# Altium project Shank_v2.0 Project.PrjPcb
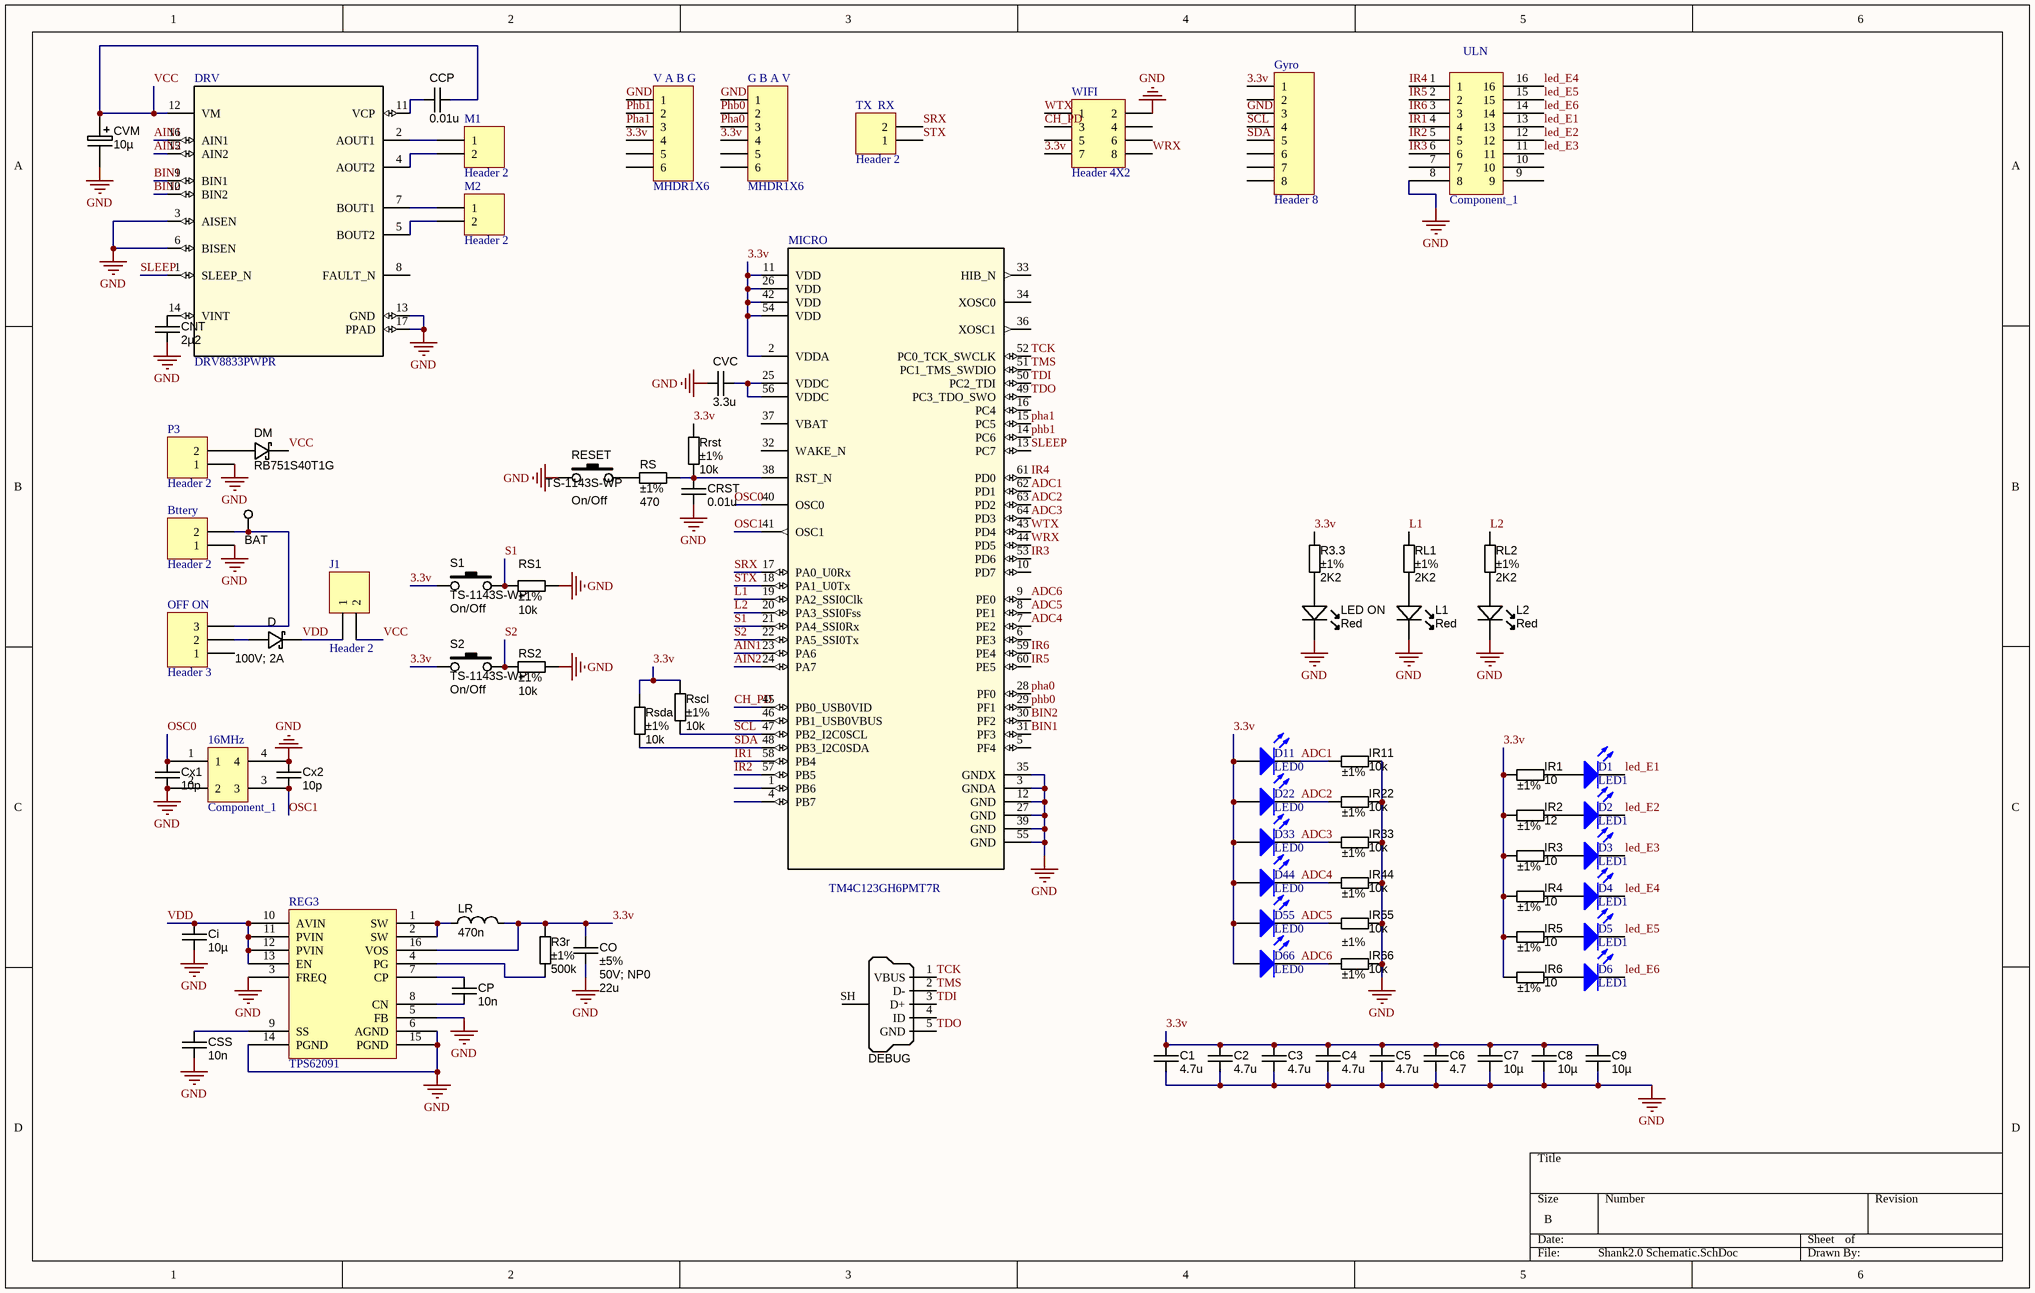
[diagram p0: Shank2.0 Schematic.SchDoc]
1 sheet, 81 parts. Net scope: global (net labels, ports and power ports of the same name join across sheets).
Board file: Shank2.0 PCB.PcbDoc

## Sheet Shank2.0 Schematic.SchDoc
size B

### Parts
16MHz  Component_1  [16Mhz]
BAT  TESTPOINT_LEAD  [THP_D46_T80_B80]  (value not drawn)  (no BOM)
Bttery  Header 2  [HDR1X2]
C1  value 4.7u  [CAPC2012X135N]  (hidden comment: approved sub OK)
C2  value 4.7u  [CAPC2012X135N]  (hidden comment: approved sub OK)
C3  value 4.7u  [CAPC2012X135N]  (hidden comment: approved sub OK)
C4  value 4.7u  [CAPC2012X135N]  (hidden comment: approved sub OK)
C5  value 4.7u  [CAPC2012X135N]  (hidden comment: approved sub OK)
C6  value 4.7  [CAPC2012X135N]  (hidden comment: approved sub OK)
C7  value 10µ  [CAPC2012X135N]  (hidden comment: approved sub OK)
C8  value 10µ  [CAPC2012X135N]  (hidden comment: approved sub OK)
C9  value 10µ  [CAPC2012X135N]  (hidden comment: approved sub OK)
CCP  value 0.01u  [CAPC2012X135N]  (hidden comment: approved sub OK)
Ci  value 10µ  [CAPC2012X135N]  (hidden comment: approved sub OK)
CNT  value 2µ2  [CAPC2012X135N]  (hidden comment: approved sub OK)
CO  Tolerance: ±5%  Ratings: 50V; NP0  [CAPC3216X180N]  (hidden comment: 22u)
CP  value 10n  [CAPC2012X135N]  (hidden comment: approved sub OK)
CRST  value 0.01u  [CAPC2012X135N]  (hidden comment: approved sub OK)
CSS  value 10n  [CAPC2012X135N]  (hidden comment: approved sub OK)
CVC  value 3.3u  [CAPC2012X135N]  (hidden comment: approved sub OK)
CVM  10µ  [CAPC3216X175N]
Cx1  value 10p  [CAPC2012X135N]  (hidden comment: approved sub OK)
Cx2  value 10p  [CAPC2012X135N]  (hidden comment: approved sub OK)
D  Ratings: 100V; 2A  [Schottky]  (hidden comment: DIODE_SCHOTTKY_10MQ100NPBF)
D1  LED1  [LED-v3.0]
D2  LED1  [LED-v3.0]
D3  LED1  [LED-v3.0]
D4  LED1  [LED-v3.0]
D5  LED1  [LED-v3.0]
D6  LED1  [LED-v3.0]
D11  LED0  [LED-1]
D22  LED0  [LED-1]
D33  LED0  [LED-1]
D44  LED0  [LED-1]
D55  LED0  [LED-1]
D66  LED0  [LED-1]
DEBUG  USB Micro Type B (recommended if hand soldering)  [USB_Micro-B_FCI_SMD]  (value not drawn)
DM  Manufacturer Part Number 1: RB751S40T1G  [Schottky]  (hidden comment: Low Ir)
DRV  DRV8833PWPR  [PWP0016C_N]
G_B_A_V  MHDR1X6  [Header Encoder]
Gyro  Header 8  [Header Gyroscope]
IR1  value 10  Tolerance: ±1%  [RESC3216N_ZERO]  (hidden comment: Thick Film)
IR2  value 12  Tolerance: ±1%  [RESC3216N_ZERO]  (hidden comment: Thick Film)
IR3  value 10  Tolerance: ±1%  [RESC3216X70N]  (hidden comment: Thick Film)
IR4  value 10  Tolerance: ±1%  [RESC3216X70N]  (hidden comment: Thick Film)
IR5  value 10  Tolerance: ±1%  [RESC3216X70N]  (hidden comment: Thick Film)
IR6  value 10  Tolerance: ±1%  [RESC3216X70N]  (hidden comment: Thick Film)
IR11  value 10k  Tolerance: ±1%  [RESC2012X70N]  (hidden comment: Thick Film)
IR22  value 10k  Tolerance: ±1%  [RESC2012X70N]  (hidden comment: Thick Film)
IR33  value 10k  Tolerance: ±1%  [RESC2012X70N]  (hidden comment: Thick Film)
IR44  value 10k  Tolerance: ±1%  [RESC2012X70N]  (hidden comment: Thick Film)
IR55  value 10k  Tolerance: ±1%  [RESC2012X70N]  (hidden comment: Thick Film)
IR66  value 10k  Tolerance: ±1%  [RESC2012X70N]  (hidden comment: Thick Film)
J1  Header 2  [HDR1X2]
L1  Color: Red  [LED-0805-K]
L2  Color: Red  [LED-0805-K]
LED_ON  Color: Red  [LED-0805-K]
LR  470n  [INDM2520X190N]
M1  Header 2  [HDR1X2]
M2  Header 2  [HDR1X2]
MICRO  TM4C123GH6PMT7R  [LQFP50P1200X1200X160-64]
OFF_ON  Header 3  [SW ON-ON]
P3  Header 2  [HDR1X2]
R3.3  value 2K2  Tolerance: ±1%  [RESC2012X70N]  (hidden comment: Thick Film)
R3r  value 500k  Tolerance: ±1%  [RESC2012X70N]  (hidden comment: Thick Film)
REG3  TPS62091  [TPS62091 v2]
RESET  TS-1143S-WP  Function: On/Off  [Switche GP]
RL1  value 2K2  Tolerance: ±1%  [RESC2012X70N]  (hidden comment: Thick Film)
RL2  value 2K2  Tolerance: ±1%  [RESC2012X70N]  (hidden comment: Thick Film)
Rrst  value 10k  Tolerance: ±1%  [RESC2012X70N]  (hidden comment: Thick Film)
RS  value 470  Tolerance: ±1%  [RESC2012X70N]  (hidden comment: Thick Film)
RS1  value 10k  Tolerance: ±1%  [RESC2012X70N]  (hidden comment: Thick Film)
RS2  value 10k  Tolerance: ±1%  [RESC2012X70N]  (hidden comment: Thick Film)
Rscl  value 10k  Tolerance: ±1%  [RESC2012X70N]  (hidden comment: Thick Film)
Rsda  value 10k  Tolerance: ±1%  [RESC2012X70N]  (hidden comment: Thick Film)
S1  TS-1143S-WP  Function: On/Off  [Switche GP]
S2  TS-1143S-WP  Function: On/Off  [Switche GP]
TX_RX  Header 2  [HDR1X2]
ULN  Component_1  [TSSOP65P640X120-16N]
V_A_B_G  MHDR1X6  [Header Encoder]
WIFI  Header 4X2  [HDR2X4]

### Nets
GND: 16MHz.2 16MHz.4 Bttery.1 C1.1 C2.1 C3.1 C4.1 C5.1 C6.1 C7.1 C8.1 C9.1 Ci.2 CNT.2 CO.2 CRST.2 CSS.2 CVC.2 CVM.2 Cx1.1 Cx2.1 DRV.3(AISEN) DRV.6(BISEN) DRV.13(GND) DRV.17(PPAD) G_B_A_V.1 Gyro.3 IR11.2 IR22.2 IR33.2 IR44.2 IR55.2 IR66.2 L1.K L2.K LED_ON.K MICRO.3(GNDA) MICRO.12(GND) MICRO.27(GND) MICRO.35(GNDX) MICRO.39(GND) MICRO.55(GND) P3.1 REG3.3(FREQ) REG3.5(FB) REG3.6(AGND) REG3.14(PGND) REG3.15(PGND) RESET.1 RS1.1 RS2.2 ULN.8 V_A_B_G.1 WIFI.2
3.3v: C1.2 C2.2 C3.2 C4.2 C5.2 C6.2 C7.2 C8.2 C9.2 CO.1 D11.1(A) D22.1(A) D33.1(A) D44.1(A) D55.1(A) D66.1(A) G_B_A_V.4 Gyro.1 IR1.1 IR2.1 IR3.1 IR4.1 IR5.1 IR6.1 LR.2 MICRO.2(VDDA) MICRO.11(VDD) MICRO.26(VDD) MICRO.42(VDD) MICRO.54(VDD) R3.3.1 R3r.1 REG3.16(VOS) Rrst.1 Rscl.1 Rsda.1 S1.1 S2.1 V_A_B_G.4 WIFI.7
ADC1: D11.2(K) IR11.1 MICRO.62(PD1)
ADC2: D22.2(K) IR22.1 MICRO.63(PD2)
ADC3: D33.2(K) IR33.1 MICRO.64(PD3)
ADC4: D44.2(K) IR44.1 MICRO.7(PE2)
ADC5: D55.2(K) IR55.1 MICRO.8(PE1)
ADC6: D66.2(K) IR66.1 MICRO.9(PE0)
AIN1: DRV.16(AIN1) MICRO.23(PA6)
AIN2: DRV.15(AIN2) MICRO.24(PA7)
BIN1: DRV.9(BIN1) MICRO.31(PF3)
BIN2: DRV.10(BIN2) MICRO.30(PF2)
CH_PD: MICRO.45(PB0_USB0VID) WIFI.3
IR1: MICRO.58(PB4) ULN.4
IR2: MICRO.57(PB5) ULN.5
IR3: MICRO.53(PD6) ULN.6
IR4: MICRO.61(PD0) ULN.1
IR5: MICRO.60(PE5) ULN.2
IR6: MICRO.59(PE4) ULN.3
L1: MICRO.19(PA2_SSI0Clk) RL1.1
L2: MICRO.20(PA3_SSI0Fss) RL2.1
led_E1: D1.2(K) ULN.13
led_E2: D2.2(K) ULN.12
led_E3: D3.2(K) ULN.11
led_E4: D4.2(K) ULN.16
led_E5: D5.2(K) ULN.15
led_E6: D6.2(K) ULN.14
OSC0: 16MHz.1 Cx1.2 MICRO.40(OSC0)
OSC1: 16MHz.3 Cx2.2 MICRO.41(OSC1)
Pha0: G_B_A_V.3 MICRO.28(PF0)
Pha1: MICRO.15(PC5) V_A_B_G.3
Phb0: G_B_A_V.2 MICRO.29(PF1)
Phb1: MICRO.14(PC6) V_A_B_G.2
S1: MICRO.21(PA4_SSI0Rx) RS1.2 S1.2
S2: MICRO.22(PA5_SSI0Tx) RS2.1 S2.2
SCL: Gyro.4 MICRO.47(PB2_I2C0SCL) Rscl.2
SDA: Gyro.5 MICRO.48(PB3_I2C0SDA) Rsda.2
SLEEP: DRV.1(SLEEP_N) MICRO.13(PC7)
SRX: MICRO.17(PA0_U0Rx) TX_RX.2
STX: MICRO.18(PA1_U0Tx) TX_RX.1
TCK: DEBUG.1(VBUS) MICRO.52(PC0_TCK_SWCLK)
TDI: DEBUG.3(D+) MICRO.50(PC2_TDI)
TDO: DEBUG.5(GND) MICRO.49(PC3_TDO_SWO)
TMS: DEBUG.2(D-) MICRO.51(PC1_TMS_SWDIO)
VCC: CCP.2 CVM.1 DM.K DRV.12(VM) J1.2
VDD: Ci.1 D.K J1.1 REG3.10(AVIN) REG3.11(PVIN) REG3.12(PVIN) REG3.13(EN)
WRX: MICRO.44(PD5) WIFI.8
WTX: MICRO.43(PD4) WIFI.1
NetBAT_1: BAT.1 Bttery.2 OFF_ON.3
NetCCP_1: CCP.1 DRV.11(VCP)
NetCNT_1: CNT.1 DRV.14(VINT)
NetCP_1: CP.1 REG3.7(CP)
NetCP_2: CP.2 REG3.8(CN)
NetCRST_1: CRST.1 MICRO.38(RST_N) Rrst.2 RS.2
NetCSS_1: CSS.1 REG3.9(SS)
NetCVC_1: CVC.1 MICRO.25(VDDC) MICRO.56(VDDC)
NetD1_1: D1.1(A) IR1.2
NetD2_1: D2.1(A) IR2.2
NetD3_1: D3.1(A) IR3.2
NetD4_1: D4.1(A) IR4.2
NetD5_1: D5.1(A) IR5.2
NetD6_1: D6.1(A) IR6.2
NetD_A: D.A OFF_ON.2
NetDM_A: DM.A P3.2
NetDRV_2: DRV.2(AOUT1) M1.1
NetDRV_4: DRV.4(AOUT2) M1.2
NetDRV_5: DRV.5(BOUT2) M2.2
NetDRV_7: DRV.7(BOUT1) M2.1
NetL1_A: L1.A RL1.2
NetL2_A: L2.A RL2.2
NetLED_ON_A: LED_ON.A R3.3.2
NetLR_1: LR.1 REG3.1(SW) REG3.2(SW)
NetR3r_2: R3r.2 REG3.4(PG)
NetRESET_2: RESET.2 RS.1

Not connected (* = marked no-connect by the designer): DEBUG 4(ID) SH(Shell); DRV 8(FAULT_N); G_B_A_V 5 6; Gyro 2 6 7 8; MICRO 1(PB6) 4(PB7) 5(PF4) 6(PE3) 10(PD7) 16(PC4) 32(WAKE_N) 33(HIB_N) 34(XOSC0) 36(XOSC1) 37(VBAT) 46(PB1_USB0VBUS); OFF_ON 1; ULN 7 9 10; V_A_B_G 5 6; WIFI 4 5 6

### Library data of the parts
BAT = TESTPOINT_LEAD: TEST POINT
Bttery J1 M1 M2 P3 TX_RX = Header 2: Header, 2-Pin; LatestRevisionDate: 17-Jul-2002; LatestRevisionNote: Re-released for DXP Platform.; Publisher: Altium Limited
C1-C9 = CAPC_10u_0805_10V: Capacitor SMD Cer 10uF 10% 10V X5R 0805; Manufacturer 1: AVX Corporation; Manufacturer Part Number 1: 0805ZD106KAT2A; Ratings: 10V; X5R; Material: ceramic; SCDType: spec; Package / Case: 0805 (2012 metric); Tolerance: ±10%; Manufacturer 2: Kemet; Manufacturer Part Number 2: C0805C106K8PACTU; Supplier 1: Digi-Key; Supplier Part Number 1: 478-5167-1-ND; ComponentLink1URL: http://www.avx.com/docs/Catalogs/cx5r.pdf; ComponentLink1Description: http://www.avx.com/docs/Catalogs/cx5r.pdf; ComponentLink2URL: http://www.kemet.com/datasheets&C0805C106K8PACTU; ComponentLink2Description: http://www.kemet.com/datasheets&C0805C106K8PACTU; Supplier 2: Digi-Key; Supplier Part Number 2: 399-4925-1-ND
CCP CRST = CAPC_1u_0805_X7R_16V_10%: Capacitor SMD Cer 1uF 10% 16V X7R 0805; Manufacturer 1: Yageo; Manufacturer Part Number 1: CC0805KKX7R7BB105; Ratings: 16V; X7R; SCDType: spec; Package / Case: 0805 (2012 metric); Tolerance: ±10%; Material: ceramic; Supplier 1: Digi-Key; Supplier Part Number 1: 311-1365-6-ND; RoHS 1: RoHS Compliant; Temperature Coefficient: X7R; ComponentLink1URL: http://www.yageo.com/documents/recent/UPY-GPHC_X7R_6.3V-to-50V_8.pdf; ComponentLink1Description: http://www.yageo.com/documents/recent/UPY-GPHC_X7R_6.3V-to-50V_8.pdf; Supplier 2: Digi-Key; Supplier Part Number 2: 399-1284-6-ND; Manufacturer 2: Kemet; Manufacturer Part Number 2: C0805C105K4RACTU; RoHS 2: RoHS Compliant; ComponentLink2URL: http://www.kemet.com/datasheets&C0805C105K4RACTU; ComponentLink2Description: http://www.kemet.com/datasheets&C0805C105K4RACTU; Supplier 3: Digi-Key; Supplier Part Number 3: 1276-1026-6-ND; Manufacturer 3: Samsung Electro-Mechanics America, Inc; Manufacturer Part Number 3: CL21B105KOFNNNE; RoHS 3: RoHS Compliant; ComponentLink3URL: http://www.samsungsem.com/servlet/FileDownload?type=spec&file=CL21B105KOFNNNE.pdf; ComponentLink3Description: http://www.samsungsem.com/servlet/FileDownload?type=spec&file=CL21B105KOFNNNE.pdf; Supplier 4: Digi-Key; Supplier Part Number 4: 445-1358-6-ND; Manufacturer 4: TDK Corporation; Manufacturer Part Number 4: C2012X7R1C105K125AA; RoHS 4: RoHS Compliant; ComponentLink4URL: http://product.tdk.com/capacitor/mlcc/en/documents/mlcc_commercial_general_en.pdf; ComponentLink4Description: http://product.tdk.com/capacitor/mlcc/en/documents/mlcc_commercial_general_en.pdf
Ci CP CSS CVC Cx1 Cx2 = CAPC_10u_0805_10V: Capacitor SMD Cer 10uF 10% 10V X5R 0805; Manufacturer 1: AVX Corporation; Manufacturer Part Number 1: 0805ZD106KAT2A; Ratings: 10V; X5R; SCDType: spec; Package / Case: 0805 (2012 metric); Tolerance: ±10%; Material: ceramic; Manufacturer 2: Kemet; Manufacturer Part Number 2: C0805C106K8PACTU; Supplier 1: Digi-Key; Supplier Part Number 1: 478-5167-1-ND; ComponentLink1URL: http://www.avx.com/docs/Catalogs/cx5r.pdf; ComponentLink1Description: http://www.avx.com/docs/Catalogs/cx5r.pdf; ComponentLink2URL: http://www.kemet.com/datasheets&C0805C106K8PACTU; ComponentLink2Description: http://www.kemet.com/datasheets&C0805C106K8PACTU; Supplier 2: Digi-Key; Supplier Part Number 2: 399-4925-1-ND
CNT = CAPC_2u2_0805: Capacitor SMD Cer 2.2uF 10% 16V X7R 0805; Manufacturer 1: Kemet; Manufacturer Part Number 1: C0805C225K4RACTU; Ratings: 16V; X7R; SCDType: undef; Supplier 1: Digi-Key; Supplier Part Number 1: 399-3523-1-ND; Tolerance: ±10%; Package / Case: 0805 (2012 metric)
CO = CAPC_100n_1206_NP0_50V_5%: Capacitor SMD Cer 100nF 1206 NP0 50V 5%; Manufacturer 1: TDK Corporation; Manufacturer Part Number 1: C3216C0G1H104J160AA; SCDType: undef; Operating Temperature: -55°C ~ 125°C; Package / Case: 1206 (3216 Metric); Size / Dimension: 0.126" L x 0.063" W (3.20mm x 1.60mm); Thickness (Max): 0.075" (1.90mm); Supplier 1: Digi-Key; Supplier Part Number 1: 445-7694-1-ND; ComponentLink1URL: http://product.tdk.com/capacitor/mlcc/en/documents/mlcc_commercial_general_en.pdf; ComponentLink1Description: http://product.tdk.com/capacitor/mlcc/en/documents/mlcc_commercial_general_en.pdf; Value: 22u
CVM = CAPT_10u_6032_16V: Capacitor SMD Tantalum 10uF 20% 16V EIA 6032-28; Manufacturer 1: Vishay/Sprague; Manufacturer Part Number 1: 293D106X0016C2TE3; SCDType: undef; Package / Case: EIA 6032-28; Ratings: 16V; Tolerance: ±20%; Material: Tantalum; Supplier 1: Digi-Key; Supplier Part Number 1: 718-1042-1-ND; Value: 10µ
D = DIODE_SCHOTTKY_10MQ100NPBF: Diode Schottky SMD 100V 2A SMA; Manufacturer 1: Micro Commercial Co; Manufacturer Part Number 1: SS210-TP; Speed: Fast Recovery =< 500ns, > 200mA (Io); SCDType: source; Package / Case: DO-214AC, SMA; Material: Si; Diode Type: Schottky; Mounting Type: Surface Mount; Supplier 1: Digi-Key; Supplier Part Number 1: SS210-TPMSCT-ND
D1-D6 = LED1: Typical RED GaAs LED; Published: 8-Jun-2000; LatestRevisionDate: 08-Jul-2005; LatestRevisionNote: Mech Layer 1 removed.; PackageReference: LED-1; Publisher: Altium Limited; PackageDescription: LED; 2 Leads
D11 D22 D33 D44 D55 D66 = LED0: Typical INFRARED GaAs LED; Published: 8-Jun-2000; LatestRevisionDate: 08-Jul-2005; LatestRevisionNote: Mech Layer 1 removed.; PackageReference: LED-0; Publisher: Altium Limited; PackageDescription: LED; 2 Leads
DEBUG = USB_Micro_TypeB_FCI: Connector SMD-THD USB Micro Type B middle mount; Manufacturer 1: FCI; Manufacturer Part Number 1: 10103593-0001LF; SCDType: undef; Package / Case: SMD/THD mid-mount; Supplier 1: Digi-Key; Supplier Part Number 1: 609-4049-1-ND
DM = DIODE_SCHOTTKY_40V_30mA_SOD-523F: Diode Schottky SMD 40V 30mA SOD-523F; Manufacturer 1: ON Semiconductor; Ratings: 40Vmax; 30mA; Current - Reverse Leakage @ Vr: 500nA @ 30V; Current - Average Rectified (Io): 30mA (DC); Capacitance @ Vr, F: 2.5pF @ 1V, 1MHz; Voltage - Forward (Vf) (Max) @ If: 370mV @ 1mA; SCDType: source; Package / Case: SC-79, SOD-523F; Material: Si; Diode Type: Schottky; Mounting Type: Surface Mount; Supplier 1: Digi-Key; Supplier Part Number 1: RB751S40T1GOSCT-ND; ComponentLink1URL: http://www.onsemi.com/pub_link/Collateral/RB751S40T1-D.PDF; ComponentLink1Description: http://www.onsemi.com/pub_link/Collateral/RB751S40T1-D.PDF
DRV = DRV8833PWPR: Imported; Manufacturer: Texas Instruments; PartNumber: DRV8833PWPR; RefDes: RefDes; Type: DEV; Value: Value
G_B_A_V V_A_B_G = MHDR1X6: Header, 6-Pin; LatestRevisionDate: 17-Jul-2002; LatestRevisionNote: Re-released for DXP Platform.; Publisher: Altium Limited
Gyro = Header 8: Header, 8-Pin; LatestRevisionDate: 17-Jul-2002; LatestRevisionNote: Re-released for DXP Platform.; Publisher: Altium Limited
IR1-IR6 IR11 IR22 IR33 IR44 IR55 IR66 R3.3 R3r RL1 RL2 Rscl Rsda = RES_2K2_0805_1%: Resistor SMD chip 2.2k Ohm 0.125W 1% 0805; Manufacturer 1: Vishay/Dale; Manufacturer Part Number 1: CRCW08052K20FKEA; Ratings: 1/8W; SCDType: spec; Supplier 1: Digi-Key; Supplier Part Number 1: 541-2.20KCCT-ND; Package / Case: 0805 (2012 metric)
L1 L2 = LED_SMD_Red_0805_6mcd: LED 0805 SMD Red 6mcd 621nm; Manufacturer 1: Lite-On Inc; Manufacturer Part Number 1: LTST-C171EKT; Material: GaAsP on GaP; Ratings: 6 mcd; 621 nm; SCDType: source; Package / Case: 0805; Supplier 1: Digi-Key; Supplier Part Number 1: 160-1422-1-ND; Value: Red
LED_ON = LED_SMD_Red_0805_6mcd: LED 0805 SMD Red 6mcd 621nm; Manufacturer 1: Lite-On Inc; Manufacturer Part Number 1: LTST-C171EKT; Ratings: 6 mcd; 621 nm; SCDType: source; Package / Case: 0805; Material: GaAsP on GaP; Supplier 1: Digi-Key; Supplier Part Number 1: 160-1422-1-ND; Value: Red
LR = INDC_150n_1008: Inductor SMD chip 150nH 1008; Manufacturer 1: TDK Corporation; Manufacturer Part Number 1: NLV25T-R15J-PF; Ratings: 500 mA; Tolerance: ±5%; SCDType: spec; Package / Case: 1008 (2520 Metric); Supplier 1: Digi-Key; Supplier Part Number 1: 445-1715-1-ND; Value: 470n
MICRO = TM4C123GH6PMT7R: Imported; PartNumber: TM4C123GH6PMTR; Manufacturer: Texas Instruments; CompType: IC; PIN_COUNT: 64; Application_BuildNumber: *; Alternate PartNumber: TM4C123GH6PMT; PackageReference: PM0064A; MountType: SMT; RoHS: Y; RefDes: RefDes; Type: DEV; Value: Value
OFF_ON = Header 3: Header, 3-Pin; LatestRevisionDate: 17-Jul-2002; LatestRevisionNote: Re-released for DXP Platform.; Publisher: Altium Limited
RESET S1 S2 = SW_SMD_PB_4.3mm: Switch SMD Tact 4.3mm Stem; Manufacturer 1: Bond-Tact; Manufacturer Part Number 1: TS-1143S-WP-200; SCDType: spec; Package / Case: 6.5x6.5mm; 4.3mm stem
Rrst RS = RES_205K_0805_1%: Resistor SMD chip 205k Ohm 0.125W 1% 0805; Manufacturer 1: Vishay/Dale; Manufacturer Part Number 1: CRCW0805205KFKEA; Ratings: 1/8W; SCDType: spec; Package / Case: 0805 (2012 metric); Supplier 1: Digi-Key; Supplier Part Number 1: 541-205KCCT-ND
RS1 RS2 = RES_1K5_0805_1%: Resistor SMD chip 1.5k Ohm 0.125W 1% 0805; Manufacturer 1: Vishay/Dale; Manufacturer Part Number 1: CRCW08051K50FKEA; Ratings: 1/8W; SCDType: spec; Package / Case: 0805 (2012 metric); Supplier 1: Digi-Key; Supplier Part Number 1: 541-1.50KCCT-ND
WIFI = Header 4X2: Header, 4-Pin, Dual row; LatestRevisionDate: 17-Jul-2002; LatestRevisionNote: Re-released for DXP Platform.; Publisher: Altium Limited